# EAGLE design FRDM-Robot-Rev1.9 (EAGLE 6.4)
FRDM-Robot Board
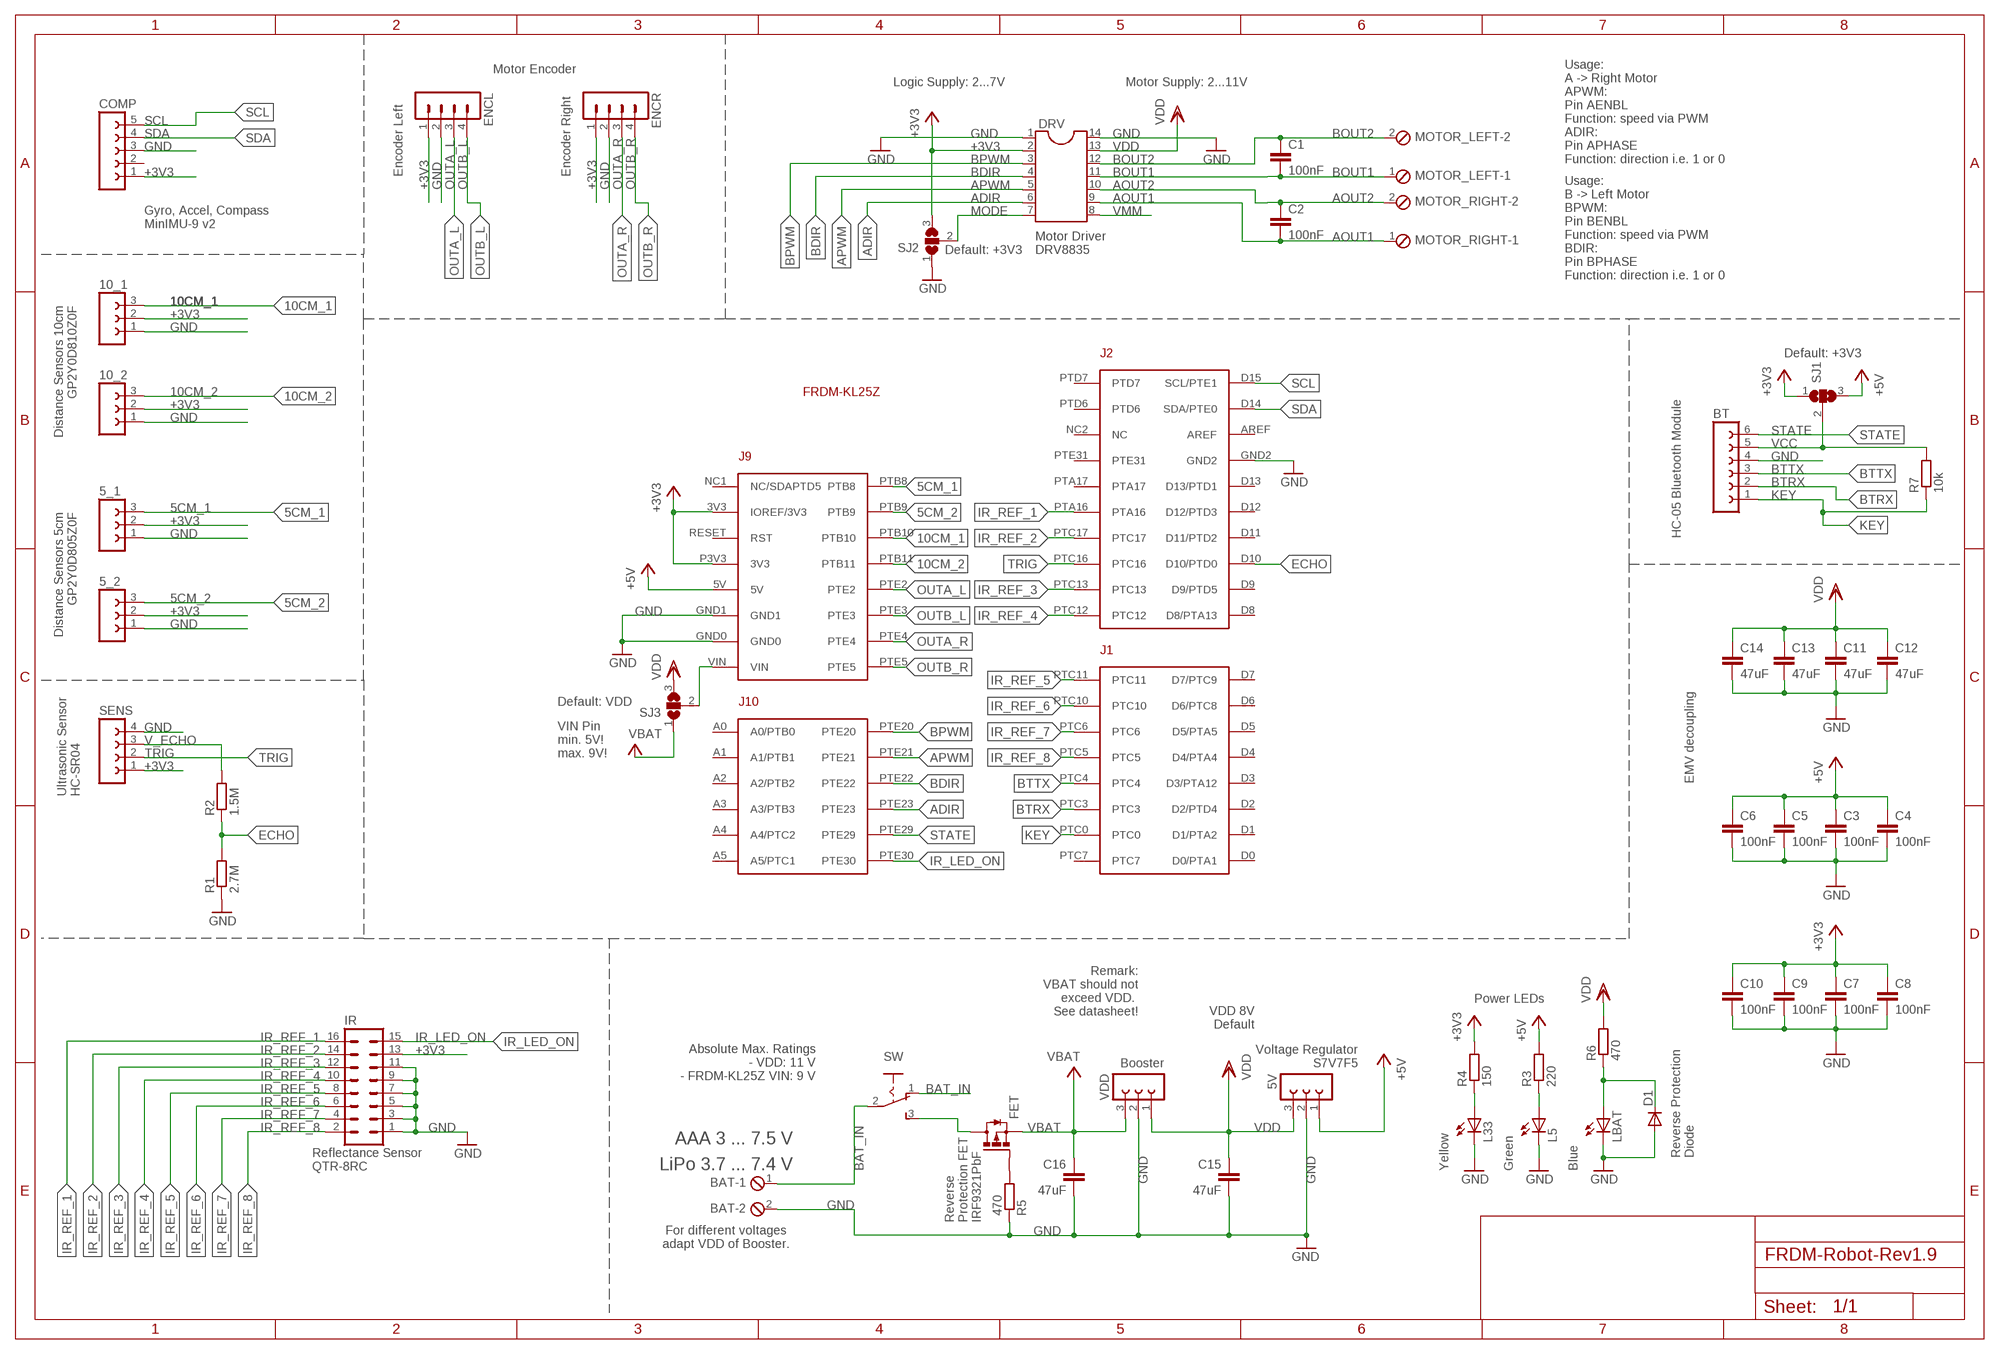
[diagram p0: schematic, sheet 1]

## Parts
5_1  FE03-1  [FE03-1]
5_2  FE03-1  [FE03-1]
5V  FE03-1  [FE03-1]
10_1  FE03-1  [FE03-1]
10_2  FE03-1  [FE03-1]
BAT  MPT2  [2POL254]
BT  FE06-1  [FE06]
C1  100nF  C-EUC0805  [C0805]
C2  100nF  C-EUC0805  [C0805]
C3  100nF  C-EUC0805  [C0805]
C4  100nF  C-EUC0805  [C0805]
C5  100nF  C-EUC0805  [C0805]
C6  100nF  C-EUC0805  [C0805]
C7  100nF  C-EUC0805  [C0805]
C8  100nF  C-EUC0805  [C0805]
C9  100nF  C-EUC0805  [C0805]
C10  100nF  C-EUC0805  [C0805]
C11  47uF  C-EUC0805  [C0805]
C12  47uF  C-EUC0805  [C0805]
C13  47uF  C-EUC0805  [C0805]
C14  47uF  C-EUC0805  [C0805]
C15  47uF  C-EUC0805  [C0805]
C16  47uF  C-EUC0805  [C0805]
COMP  FE05-1  [FE05-1]
D1  DIODE-SOD123  [SOD123]
DRV  DIL14  [DIL14]
ENCL  MA04-1  [MA04-1]
ENCR  MA04-1  [MA04-1]
FET  P-MOSFET-SO8  [SO-08]
FRDM1  FRDM-KL25ZARDUINO  [FRDM-KL25Z]
IR  MA08-2  [MA08-2]
L5  LEDCHIP-LED0603  [CHIP-LED0603]
L33  LEDCHIP-LED0603  [CHIP-LED0603]
LBAT  LEDCHIP-LED0603  [CHIP-LED0603]
MOTOR_LEFT  MPT2  [2POL254]
MOTOR_RIGHT  MPT2  [2POL254]
R1  2.7M  R-EU_M0805  [M0805]
R2  1.5M  R-EU_M0805  [M0805]
R3  220  R-EU_M0805  [M0805]
R4  150  R-EU_M0805  [M0805]
R5  470  R-EU_M0805  [M0805]
R6  470  R-EU_M0805  [M0805]
R7  10k  R-EU_M0805  [M0805]
SENS  FE04-1  [FE04-1]
SJ1  SJ2W  [SJ_2]
SJ2  SJ2W  [SJ_2]
SJ3  SJ2W  [SJ_2]
SW  KNITTER-MFP106D  [KNITTER-MFP106D]
VDD  FE03-1  [FE03-1]

## Nets
5CM_1: 5_1.3 FRDM1.PTB8
5CM_2: 5_2.3 FRDM1.PTB9
10CM_1: 10_1.3 FRDM1.PTB10
10CM_2: 10_2.3 FRDM1.PTB11
+3V3: 5_1.2 5_2.2 10_1.2 10_2.2 C7.1 C8.1 C9.1 C10.1 COMP.1 DRV.2 ENCL.1 ENCR.1 FRDM1.3V3(IOREF/3V3) FRDM1.P3V3(3V3) IR.13 R4.2 SENS.1 SJ1.1 SJ2.3
+5V: 5V.1 C3.1 C4.1 C5.1 C6.1 FRDM1.5V R3.2 SJ1.3
ADIR: DRV.6 FRDM1.PTE23
AOUT1: C2.2 DRV.9 MOTOR_RIGHT.1
AOUT2: C2.1 DRV.10 MOTOR_RIGHT.2
APWM: DRV.5 FRDM1.PTE21
BAT-FET: FET.5(D) FET.6(D) FET.7(D) FET.8(D) SW.3(S)
BAT_IN: BAT.1 SW.1(O) SW.2(P)
BDIR: DRV.4 FRDM1.PTE22
BOUT1: C1.2 DRV.11 MOTOR_LEFT.1
BOUT2: C1.1 DRV.12 MOTOR_LEFT.2
BPWM: DRV.3 FRDM1.PTE20
BTRX: BT.2 FRDM1.PTC3
BTTX: BT.3 FRDM1.PTC4
ECHO: FRDM1.D10(D10/PTD0) R1.2 R2.1
GND: 5_1.1 5_2.1 5V.2 10_1.1 10_2.1 BAT.2 BT.4 C3.2 C4.2 C5.2 C6.2 C7.2 C8.2 C9.2 C10.2 C11.2 C12.2 C13.2 C14.2 C15.2 C16.2 COMP.3 D1.A DRV.1 DRV.14 ENCL.2 ENCR.2 FRDM1.GND0 FRDM1.GND1 FRDM1.GND2 IR.1 IR.3 IR.5 IR.7 IR.9 IR.11 L5.C L33.C LBAT.C R1.1 R5.1 SENS.4 SJ2.1 VDD.2
IR_LED_ON: FRDM1.PTE30 IR.15
IR_REF_1: FRDM1.PTA16 IR.16
IR_REF_2: FRDM1.PTC17 IR.14
IR_REF_3: FRDM1.PTC13 IR.12
IR_REF_4: FRDM1.PTC12 IR.10
IR_REF_5: FRDM1.PTC11 IR.8
IR_REF_6: FRDM1.PTC10 IR.6
IR_REF_7: FRDM1.PTC6 IR.4
IR_REF_8: FRDM1.PTC5 IR.2
KEY: BT.1 FRDM1.PTC0 R7.1
MODE: DRV.7 SJ2.2
N$1: L5.A R3.1
N$3: L33.A R4.1
N$5: FET.4(G) R5.2
N$6: D1.C LBAT.A R6.1
OUTA_L: ENCL.3 FRDM1.PTE2
OUTA_R: ENCR.3 FRDM1.PTE4
OUTB_L: ENCL.4 FRDM1.PTE3
OUTB_R: ENCR.4 FRDM1.PTE5
SCL: COMP.5 FRDM1.D15(SCL/PTE1)
SDA: COMP.4 FRDM1.D14(SDA/PTE0)
STATE: BT.6 FRDM1.PTE29
TRIG: FRDM1.PTC16 SENS.2
V_ECHO: R2.2 SENS.3
VBAT: C16.1 FET.1(S) FET.2(S) FET.3(S) SJ3.1 VDD.3
VCC: BT.5 R7.2 SJ1.2
VDD: 5V.3 C11.1 C12.1 C13.1 C14.1 C15.1 DRV.13 R6.2 SJ3.3 VDD.1
VIN: FRDM1.VIN SJ3.2
VMM: DRV.8
Unconnected: COMP.2 FRDM1.A0(A0/PTB0) FRDM1.A1(A1/PTB1) FRDM1.A2(A2/PTB2) FRDM1.A3(A3/PTB3) FRDM1.A4(A4/PTC2) FRDM1.A5(A5/PTC1) FRDM1.AREF FRDM1.D0(D0/PTA1) FRDM1.D1(D1/PTA2) FRDM1.D2(D2/PTD4) FRDM1.D3(D3/PTA12) FRDM1.D4(D4/PTA4) FRDM1.D5(D5/PTA5) FRDM1.D6(D6/PTC8) FRDM1.D7(D7/PTC9) FRDM1.D8(D8/PTA13) FRDM1.D9(D9/PTD5) FRDM1.D11(D11/PTD2) FRDM1.D12(D12/PTD3) FRDM1.D13(D13/PTD1) FRDM1.NC1(NC/SDAPTD5) FRDM1.NC2(NC) FRDM1.PTA17 FRDM1.PTC7 FRDM1.PTD6 FRDM1.PTD7 FRDM1.PTE31 FRDM1.RESET(RST)

## Notes on the sheet
- Motor Encoder
- Logic Supply: 2...7V | Motor Supply: 2...11V
- Usage:
  A -> Right Motor
  APWM: 
  Pin AENBL 
  Function: speed via PWM
  ADIR: 
  Pin APHASE 
  Function: direction i.e. 1 or 0
- Encoder Left | Encoder Right
- Gyro, Accel, Compass
  MinIMU-9 v2
- Default: +3V3
- Motor Driver
  DRV8835
- Usage:
  B -> Left Motor
  BPWM: 
  Pin BENBL 
  Function: speed via PWM
  BDIR: 
  Pin BPHASE 
  Function: direction i.e. 1 or 0
- Distance Sensors 10cm
  GP2Y0D810Z0F
- Default: +3V3
- Distance Sensors 5cm
  GP2Y0D805Z0F
- HC-05 Bluetooth Module
- Default: VDD
- VIN Pin
  min. 5V!
  max. 9V!
- EMV decoupling
- Ultrasonic Sensor
  HC-SR04
- Power LEDs
- Remark:
  VBAT should not
  exceed VDD. 
  See datasheet!
- VDD 8V
  Default
- Booster
- Voltage Regulator
  S7V7F5
- Absolute Max. Ratings
  - VDD: 11 V
  - FRDM-KL25Z VIN: 9 V
- AAA 3 ... 7.5 V
- Reverse Protection
  Diode
- Reflectance Sensor
  QTR-8RC
- LiPo 3.7 ... 7.4 V | Yellow | Green | Blue
- Reverse
  Protection FET
  IRF9321PbF
- For different voltages 
  adapt VDD of Booster.

## Library data of the parts
5_1 5_2 5V 10_1 10_2 VDD = con-lsta-FRDM:FE03-1: Female Header
BAT MOTOR_LEFT MOTOR_RIGHT = con-phoenix-254-FRDM:MPT2: PHOENIX CONNECTOR; OC_FARNELL: unknown; OC_NEWARK: unknown
BT = con-lsta-FRDM:FE06-1: FEMALE HEADER; OC_FARNELL: unknown; OC_NEWARK: unknown
C1-C16 = rcl:C-EU: CAPACITOR, European symbol
COMP = con-lsta-FRDM:FE05-1: FEMALE HEADER; OC_FARNELL: unknown; OC_NEWARK: unknown
D1 = diode:DIODE-: DIODE
DRV = ic-package-FRDM:DIL14: Dual In Line / Socket
ENCL ENCR = con-lstb-FRDM:MA04-1: PIN HEADER; OC_FARNELL: unknown; OC_NEWARK: unknown
FET = transistor-power-IRF-FRDM:P-MOSFET-SO8: P-Channel MOSFET Example: FDS4435A; P-Channel Logic Level PowerTrench® MOSFET FDS4465; P-Channel 1.8V Specified PowerTrench® MOSFET Source: www.fairchildsemi.com
FRDM1 = Freedom:FRDM-KL25Z: For creating FRDM-KL25Z shields
IR = con-lstb-FRDM:MA08-2: PIN HEADER; OC_FARNELL: unknown; OC_NEWARK: unknown
L5 L33 LBAT = led:LED: LED OSRAM: - CHIPLED LG R971, LG N971, LY N971, LG Q971, LY Q971, LO R971, LY R971 LH N974, LH R974 LS Q976, LO Q976, LY Q976 LO Q996 - Hyper CHIPLED LW Q18S LB Q993, LB Q99A, LB R99A - SideLED LS A670, LO A670, LY A670, LG A670, LP A670 LB A673, LV A673, LT A673, LW A673 LH A674 LY A675 LS A676, LA A676, LO A676, LY A676, LW A676 LS A679, LY A679, LG A679 - Hyper Micro SIDELED® LS Y876, LA Y876, LO Y876, LY Y876 LT Y87S - SmartLED LW L88C, LW L88S LB L89C, LB L89S, LG L890 LS L89K, LO L89K, LY L89K LS L896, LA L896, LO L896, LY L896 - TOPLED LS T670, LO T670, LY T670, LG T670, LP T670 LSG T670, LSP T670, LSY T670, LOP T670, LYG T670 LG T671, LOG T671, LSG T671 LB T673, LV T673, LT T673, LW T673 LH T674 LS T676, LA T676, LO T676, LY T676, LB T676, LH T676, LSB T676, LW T676 LB T67C, LV T67C, LT T67C, LS T67K, LO T67K, LY T67K, LW E67C LS E67B, LA E67B, LO E67B, LY E67B, LB E67C, LV E67C, LT E67C LW T67C LS T679, LY T679, LG T679 LS T770, LO T770, LY T770, LG T770, LP T770 LB T773, LV T773, LT T773, LW T773 LH T774 LS E675, LA E675, LY E675, LS T675 LS T776, LA T776, LO T776, LY T776, LB T776 LHGB T686 LT T68C, LB T68C - Hyper Mini TOPLED® LB M676 - Mini TOPLED Santana® LG M470 LS M47K, LO M47K, LY M47K Source: http://www.osram.convergy.de LUXEON: - LUMILED® LXK2-PW12-R00, LXK2-PW12-S00, LXK2-PW14-U00, LXK2-PW14-V00 LXK2-PM12-R00, LXK2-PM12-S00, LXK2-PM14-U00 LXK2-PE12-Q00, LXK2-PE12-R00, LXK2-PE12-S00, LXK2-PE14-T00, LXK2-PE14-U00 LXK2-PB12-K00, LXK2-PB12-L00, LXK2-PB12-M00, LXK2-PB14-N00, LXK2-PB14-P00, LXK2-PB14-Q00 LXK2-PR12-L00, LXK2-PR12-M00, LXK2-PR14-Q00, LXK2-PR14-R00 LXK2-PD12-Q00, LXK2-PD12-R00, LXK2-PD12-S00 LXK2-PH12-R00, LXK2-PH12-S00 LXK2-PL12-P00, LXK2-PL12-Q00, LXK2-PL12-R00 Source: www.luxeon.com KINGBRIGHT: KA-3528ASYC Source: www.kingbright.com
R1-R7 = resistor:R-EU_: RESISTOR, European symbol
SENS = con-lsta-FRDM:FE04-1: Female Header
SJ1-SJ3 = jumper:SJ2W: SMD solder JUMPER
SW = switch-FRDM:KNITTER-MFP106D: SLIDING SWITCH Knitter-Switch MFP 106 D Farnell <http://ch.farnell.com/knitter-switch/mfp106d/schiebeschalter-ein-ein/dp/807527>; FARNELL: 807527

## Net classes
0 default: clearance 0.355 mm

## Board
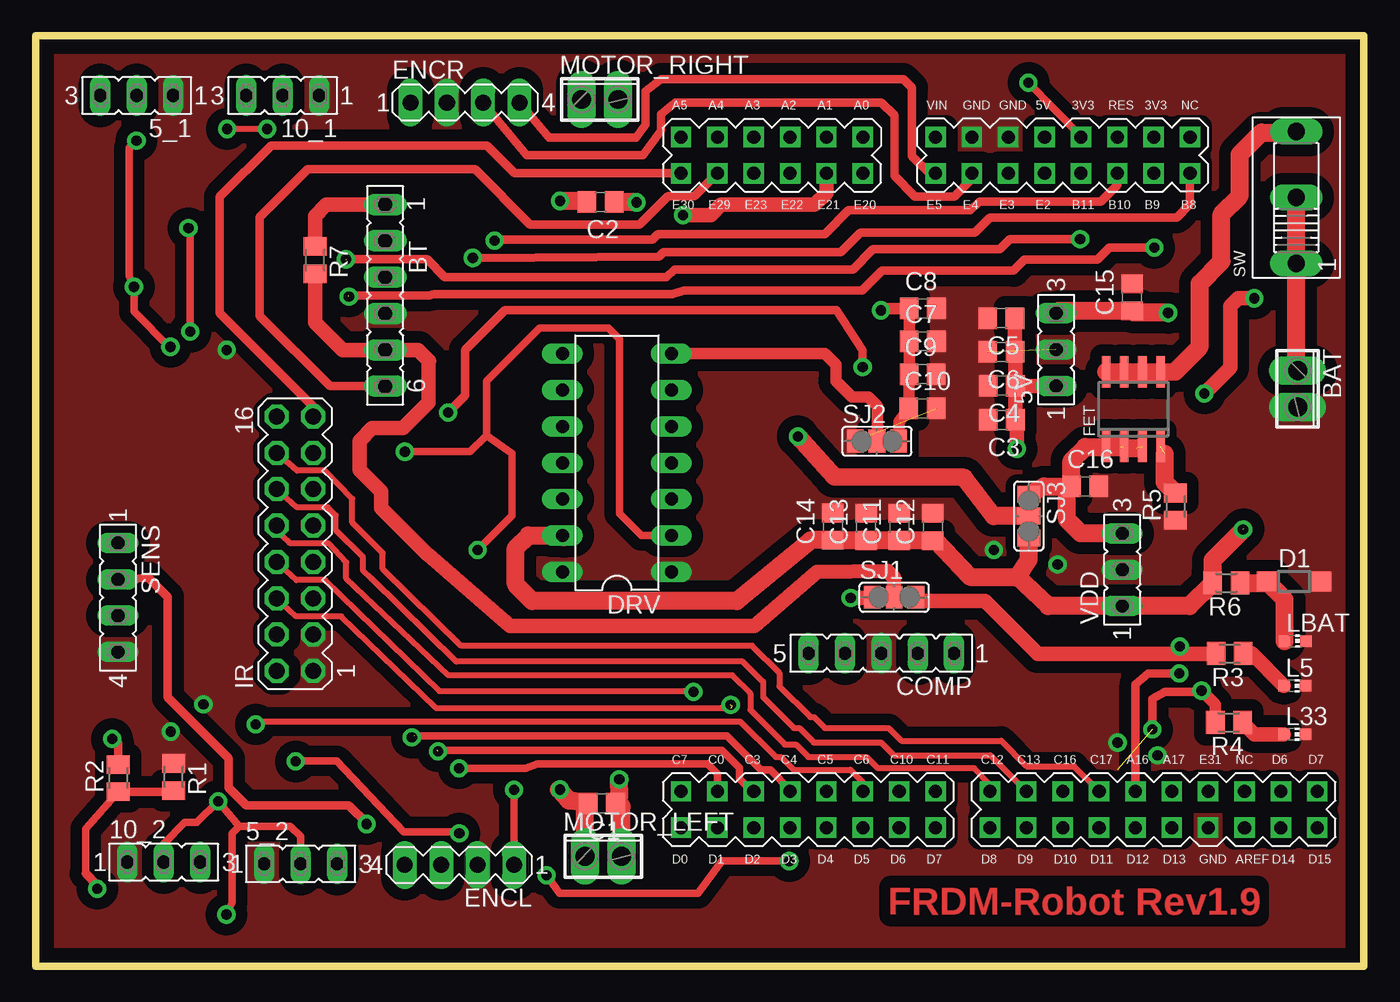
[diagram p1: board, top side]
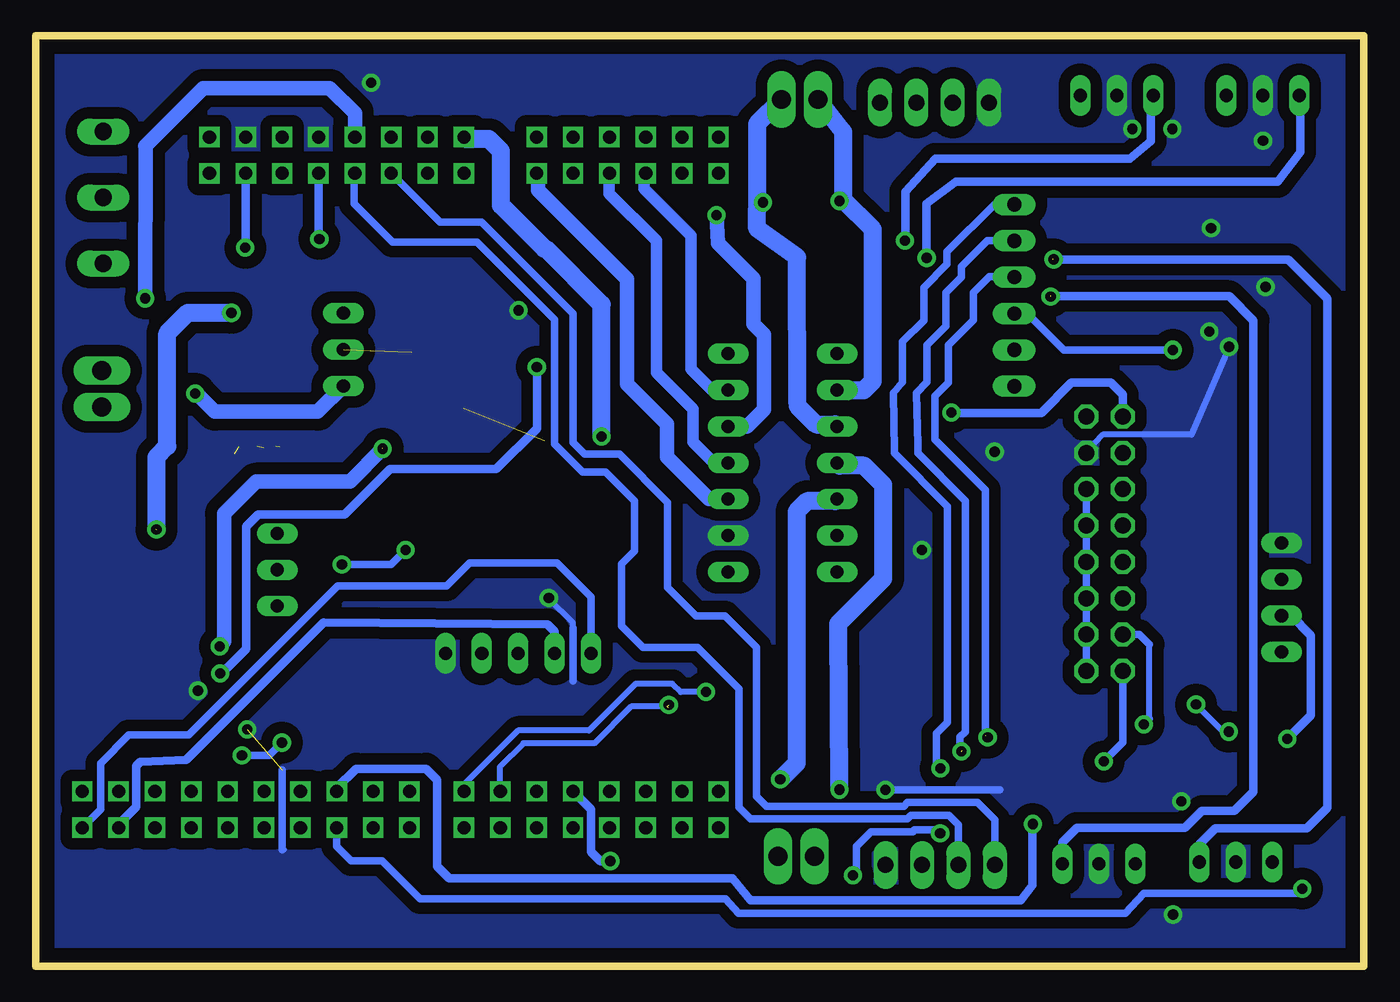
[diagram p2: board, bottom side, seen from below]

Size 92.76 x 65 mm. Coordinates in mm from the lower left corner, seen from the top.
Outline: 0,0 92.76,0 92.76,65 0,65 0,0
Copper layers (1*16): Top 0.035mm / dielectric 1.5mm / Bottom 0.035mm
Design rules "default": minimum track width 10mil, minimum drill 24mil, track to track 8mil, track to pad 8mil, pad to pad 8mil, via to via 8mil, smd to smd 8mil, copper to edge 40mil, drill to drill 8mil, minimum pad ring 10mil, minimum via ring 8mil, stop-mask expansion 4mil, vias tented up to drill 0mil, thermal gap 10mil

### Footprints (pad centres in the part's own frame; a part is rotated, then mirrored left to right if it is on the bottom)
FE03-1 = drill 0.914 long: 1 -2.54,0; 2 0,0; 3 2.54,0
2POL254 = drill 1.321 long: 1 -1.27,0; 2 1.27,0
FE06 = drill 0.991 long: 1 -6.35,0; 2 -3.81,0; 3 -1.27,0; 4 1.27,0; 5 3.81,0; 6 6.35,0
C0805 = smd 1.3 x 1.5: 1 -0.95,0; 2 0.95,0
FE05-1 = drill 0.914 long: 1 -5.08,0; 2 -2.54,0; 3 0,0; 4 2.54,0; 5 5.08,0
SOD123 = smd 1.4 x 1.4: A 1.9,0; C -1.9,0
DIL14 = drill 0.914 long: 1 -7.62,-3.81; 2 -5.08,-3.81; 3 -2.54,-3.81; 4 0,-3.81; 5 2.54,-3.81; 6 5.08,-3.81; 7 7.62,-3.81; 8 7.62,3.81; 9 5.08,3.81; 10 2.54,3.81; 11 0,3.81; 12 -2.54,3.81; 13 -5.08,3.81; 14 -7.62,3.81
MA04-1 = drill 1.118 long: 1 -3.81,0; 2 -1.27,0; 3 1.27,0; 4 3.81,0
SO-08 = smd 0.6 x 2.2: 1 -1.905,-2.6; 2 -0.635,-2.6; 3 0.635,-2.6; 4 1.905,-2.6; 5 1.905,2.6; 6 0.635,2.6; 7 -0.635,2.6; 8 -1.905,2.6
FRDM-KL25Z = drill 0.914 square: 3V3 -22.86,12.7; 5V -22.86,5.08; A0 -22.86,-7.62; A1 -22.86,-10.16; A2 -22.86,-12.7; A3 -22.86,-15.24; A4 -22.86,-17.78; A5 -22.86,-20.32; AREF 25.4,19.05; D0 25.4,-20.32; D1 25.4,-17.78; D2 25.4,-15.24; D3 25.4,-12.7; D4 25.4,-10.16; D5 25.4,-7.62; D6 25.4,-5.08; D7 25.4,-2.54; D8 25.4,1.27; D9 25.4,3.81; D10 25.4,6.35; D11 25.4,8.89; D12 25.4,11.43; D13 25.4,13.97; D14 25.4,21.59; D15 25.4,24.13; GND0 -22.86,0; GND1 -22.86,2.54; GND2 25.4,16.51; NC1 -22.86,15.24; NC2 22.86,19.05; P3V3 -22.86,7.62; PTA16 22.86,11.43; PTA17 22.86,13.97; PTB8 -20.32,15.24; PTB9 -20.32,12.7; PTB10 -20.32,10.16; PTB11 -20.32,7.62; PTC0 22.86,-17.78; PTC3 22.86,-15.24; PTC4 22.86,-12.7; PTC5 22.86,-10.16; PTC6 22.86,-7.62; PTC7 22.86,-20.32; PTC10 22.86,-5.08; PTC11 22.86,-2.54; PTC12 22.86,1.27; PTC13 22.86,3.81; PTC16 22.86,6.35; PTC17 22.86,8.89; PTD6 22.86,21.59; PTD7 22.86,24.13; PTE2 -20.32,5.08; PTE3 -20.32,2.54; PTE4 -20.32,0; PTE5 -20.32,-2.54; PTE20 -20.32,-7.62; PTE21 -20.32,-10.16; PTE22 -20.32,-12.7; PTE23 -20.32,-15.24; PTE29 -20.32,-17.78; PTE30 -20.32,-20.32; PTE31 22.86,16.51; RESET -22.86,10.16; VIN -22.86,-2.54
MA08-2 = drill 1.118 octagon: 1 -8.89,-1.27; 2 -8.89,1.27; 3 -6.35,-1.27; 4 -6.35,1.27; 5 -3.81,-1.27; 6 -3.81,1.27; 7 -1.27,-1.27; 8 -1.27,1.27; 9 1.27,-1.27; 10 1.27,1.27; 11 3.81,-1.27; 12 3.81,1.27; 13 6.35,-1.27; 14 6.35,1.27; 15 8.89,-1.27; 16 8.89,1.27
CHIP-LED0603 = smd 0.8 x 0.8: A 0,-0.75; C 0,0.75
M0805 = smd 1.3 x 1.6: 1 -0.95,0; 2 0.95,0
FE04-1 = drill 0.914 long: 1 -5.08,0; 2 -2.54,0; 3 0,0; 4 2.54,0
SJ_2 = smd 1.168 x 1.6: 1 -1.524,0; 2 0,0; 3 1.524,0
KNITTER-MFP106D = drill 1.219 long: 1 -4.61,0; 2 0,0; 3 4.61,0

### Placement (x,y rotation side)
5_1  7.05,60.83 180 top
5_2  18.5,7.15 0 top
5V  71.27,43.07 90 top
10_1  17.24,60.83 180 top
10_2  8.93,7.27 0 top
BAT  88.15,40.33 270 top
BT  24.41,46.86 270 top
C1  39.55,11.37 180 top
C2  39.45,53.39 180 top
C3  67.48,38.17 180 top
C4  67.48,40.56 180 top
C5  67.45,45.27 180 top
C6  67.45,42.91 180 top
C7  61.96,43.65 0 top
C8  61.97,45.94 0 top
C9  61.95,41.35 0 top
C10  61.93,38.97 0 top
C11  60.32,30.69 90 top
C12  62.66,30.68 90 top
C13  57.99,30.69 90 top
C14  55.68,30.71 90 top
C15  76.57,46.73 90 top
C16  73.3,33.52 0 top
COMP  59.07,21.86 180 top
D1  87.89,26.86 0 top
DRV  40.59,35.17 90 top
ENCL  29.58,7.07 180 top
ENCR  29.98,60.34 0 top
FET  76.67,38.91 0 top
FRDM1  65.39,35.07 270 top
IR  18.11,29.51 90 top
L5  87.94,19.58 270 top
L33  87.94,16.2 270 top
LBAT  88,22.72 270 top
MOTOR_LEFT  39.63,7.67 0 top
MOTOR_RIGHT  39.39,60.55 0 top
R1  9.63,13.22 270 top
R2  5.76,13.13 90 top
R3  83.39,21.84 180 top
R4  83.35,17.03 180 top
R5  79.61,32.11 90 top
R6  83.17,26.78 180 top
R7  19.52,49.33 270 top
SENS  5.74,24.49 270 top
SJ1  59.96,25.78 0 top
SJ2  58.76,36.67 0 top
SJ3  69.37,31.45 270 top
SW  88.05,53.7 90 top
VDD  75.89,27.69 90 top

### Tracks (layer width: path | path; a pad name or v marks a point on that pad's centre or on a via)
5CM_1  (via drill 0.71 pad 1.27)
  Top 0.61: FRDM1.PTB8 80.63,53.22 79.7,52.3 66.65,52.3 65.61,51.26 57.61,51.26 56.24,49.89 43.87,49.89 43.54,49.55 v30.53,49.48
  Bottom 0.61: v30.53,49.48 30.53,53.26 28.5,54.8 6.02,54.8 4.45,56.87 4.45,60.77 5_1.3
5CM_2  (via drill 0.71 pad 1.27)  (1 unrouted)
  Top 0.61: v78.13,50.19 74.98,50.19 74.14,49.35 69.06,49.35 68.3,48.59 59.11,48.59 57.71,47.19 45.24,47.19 44.48,46.94 27.81,46.94 27.43,46.86 21.87,46.86
  Bottom 0.406: v78.13,50.19 78.13,50.27
  Bottom 0.61: FRDM1.PTB9 78.09,50.31 78.13,50.27 | 5_2.3 21.04,8.66 20.04,9.65 12.5,9.65 11.3,10.85 9.04,10.85 7.7,12.19 7.7,45.11 9.4,46.81 21.84,46.81 v21.87,46.79
10CM_1  (via drill 0.71 pad 1.27)
  Top 0.61: FRDM1.PTB10 75.55,54.57 74.4,53.42 65.91,53.42 65.3,52.81 56.77,52.81 55.12,51.16 43.46,51.16 43.08,50.78 32.13,50.78 v32.05,50.7
  Bottom 0.406: 32.03,50.65 32.03,50.67 v32.05,50.7
  Bottom 0.61: 14.86,60.67 10_1.3 14.88,60.64 14.88,57.63 16.32,56.4 29.93,56.4 32.03,54.1 32.03,50.65
10CM_2  (via drill 0.71 pad 1.27)  (1 unrouted)
  Top 0.61: v72.95,50.8 68.05,50.8 67.33,50.09 58.5,50.09 57.07,48.67 44.6,48.67 44.07,48.13 28.55,48.13 27.33,49.4 21.72,49.4 21.69,49.33
  Bottom 0.406: 73.01,50.87 73.01,50.86 v72.95,50.8
  Bottom 0.61: FRDM1.PTB11 73.01,50.87 73.05,50.83 | 10_2.3 11.47,8.52 10.36,9.63 3.96,9.63 2.54,11.05 2.54,46.63 5.28,49.38 v21.67,49.38
+3V3  (via drill 0.71 pad 1.27)  (1 unrouted)
  Top 0.406: 6.53,57.18 v7.03,57.68 | v13.36,58.5 v16.15,58.5 | 10_2.2 8.93,8.22 | v12.74,11.52 12.6,11.63 | 7.04,47.28 v6.86,47.46 | 18.54,7.19 5_2.2 | 13.61,4.34 v13.32,3.6
  Top 0.508: v69.34,61.72 73.02,57.94 FRDM1.P3V3 | DRV.2 42.3,30.08 40.77,31.62 40.77,43.82 40.01,44.58 35.18,44.58 31.5,40.89 31.5,37.08 | 31.5,37.08 30.35,35.94 v25.78,35.94 | 31.5,37.08 33.27,35.81 33.27,31.5 30.99,29.21 | v10.79,44.32 10.79,51.44 v10.67,51.56 | ENCL.1 33.39,12.31 v33.4,12.32 | 6.53,57.18 6.53,48.21 v6.86,47.46 6.86,45.72 9.4,43.18 | 8.93,8.22 8.93,8.55 10.41,10.03 11.25,10.03 v12.74,11.52 14.2,9.78 14.22,9.78 | 5_2.2 18.5,9.06 17.78,9.78 14.22,9.78 | v13.32,3.6 13.72,4.45 13.72,9.27 14.22,9.78
  Top 0.61: v81.43,19.25 81.36,19.18 78.87,19.18 78,18.66 v78,16.54
  Top 0.813: R4.2 82.39,18.29 v81.43,19.25 | SJ2.3 60.28,38.01 C10.1 61,38.98 C9.1 61.01,41.37 C7.1 C8.1 59.15,45.94 v59.03,45.82
  Top 1.016: SJ1.1 58.39,25.73 v56.92,25.73
  Bottom 0.406: v9.4,43.27 12.03,37.14 18.23,37.14 19.38,35.93 IR.13 | 55.25,23.62 55.25,24 56.9,25.65 | 75.44,8.13 75.56,8.13
  Bottom 0.508: 25.4,12.32 v33.4,12.32 | 55.25,23.62 55.25,19.94 | 75.56,8.13 75.56,13.72
  other vias: 30.86,29.08
  pour Bottom (isolate 0.813, no thermals): 0.38,0.38 91.69,0.38 91.69,64.64 0.38,64.64
+5V  (via drill 0.71 pad 1.27)  (1 unrouted)
  Top 0.406: 85.13,46.67 v85.12,46.66
  Top 1.016: 68.54,36.21 68.54,38.05 C3.1 68.43,39.78 | 68.43,39.78 C4.1 68.43,42.88 C6.1 | C6.1 C5.1 | C5.1 | 68.43,42.88 C6.1 | 5V.1 68.56,40.53 68.43,39.78 | 79.89,21.81 70.02,21.81 66.29,25.53 61.73,25.53 SJ1.3 | 79.89,21.81 82.4,21.81 R3.2 | 79.89,21.81 79.89,22.31 v79.91,22.33 | v81.64,40.01 83.44,41.81 83.44,46.1 84,46.66 v85.12,46.66
  Bottom 1.016: FRDM1.5V 70.47,59.6 72.22,61.35 81.07,61.35 85.13,57.29 85.09,57.29 v85.12,46.66 | v79.91,22.33 79.6,22.68 79.6,31.62 77.37,33.86 70.82,33.86 v68.53,36.15 | 5V.1 73.07,38.73 80.26,38.73 81.53,40.01 v81.64,40.01
ADIR
  Bottom 0.813: DRV.6 45.53,40.25 46.99,41.71 46.99,51.05 50.27,54.33 50.27,55.27 FRDM1.PTE23
AOUT1  (via drill 0.71 pad 1.27)
  Top 1.27: v36.63,53.47 38.42,53.47 C2.2
  Bottom 1.27: MOTOR_RIGHT.1 36.37,58.29 36.37,53.57 | DRV.9 34.91,40.25 34.29,40.87 34.29,51.49 36.37,53.57 | 36.37,53.57 36.53,53.57 v36.63,53.47
AOUT2  (via drill 0.71 pad 1.27)
  Top 1.27: v41.96,53.37 40.42,53.37 C2.1
  Bottom 1.27: MOTOR_RIGHT.2 42.37,58.85 42.37,52.96 | 42.37,52.96 42.37,51.54 39.57,49.53 39.55,39.27 39.55,39.14 38.25,37.85 36.92,37.85 DRV.10 | 42.37,52.96 v41.96,53.37
APWM  (via drill 0.71 pad 1.27)
  Top 1.016: FRDM1.PTE21 55.22,54 54.41,53.19 47.88,53.19 47.17,52.48 v45.21,52.48
  Bottom 1.016: v45.21,52.48 45.11,50.52 42.62,48.03 42.62,44.86 41.89,44.12 41.89,38.89 43.07,37.71 DRV.5
BAT-FET
  Top 1.27: FET.8 FET.7 FET.6 FET.5 79.59,41.54 81.3,43.26 81.3,47.7 82.83,49.23 82.83,52.53 84.1,53.8 84.1,56.72 85.62,58.24 87.6,58.24 SW.3
BAT_IN
  Top 1.27: SW.2 SW.1 88.05,42.08 BAT.1
BDIR
  Bottom 0.813: DRV.4 45.4,35.16 46.86,36.63 46.86,38.94 49.4,41.48 49.4,50.67 52.71,53.98 52.71,55.37 FRDM1.PTE22
BOUT1  (via drill 0.71 pad 1.27)
  Top 1.27: MOTOR_LEFT.1 38.37,8.11 38.37,11.34 C1.2 37.22,11.57 36.55,12.33 v36.62,12.33
  Bottom 1.27: v36.62,12.33 36.7,23.93 33.55,27.08 33.55,33.63 34.9,34.98 36.59,34.98 DRV.11
BOUT2  (via drill 0.71 pad 1.27)
  Top 1.27: MOTOR_LEFT.2 40.93,8.33 40.93,11.14 C1.1 40.77,11.84 v40.76,13.04
  Bottom 1.27: DRV.12 36.92,32.49 38.89,32.49 39.62,31.75 39.62,14.18 v40.76,13.04
BPWM
  Bottom 1.016: DRV.3 45.73,32.62 48.67,35.56 48.67,37.87 51.46,40.66 51.46,48.01 57.68,54.23 57.68,55.3 FRDM1.PTE20
BTRX  (via drill 0.71 pad 1.27)  (1 unrouted)
  Top 0.508: 28.04,15.09 47.93,15.09 49.15,13.87 49.15,13.08 50.02,12.21 FRDM1.PTC3
  Bottom 0.508: BT.2 26.29,50.67 28.09,48.87 28.09,48.13 29.18,47.04 29.18,44.73 30.5,43.41 30.5,40.79 31.24,40.06 31.14,36.42 31.14,35.84 27.81,32.51 27.81,16.38 28.19,16 28.19,15.11 v28.09,15.01
BTTX  (via drill 0.71 pad 1.27)  (1 unrouted)
  Top 0.508: 26.42,16.1 48.29,16.1 50.67,13.72 51.31,13.72 52.69,12.33 FRDM1.PTC4 52.65,12.24
  Bottom 0.508: BT.3 24.43,48.16 26.16,48.16 27.25,47.07 27.25,45.14 29.01,43.38 29.01,40.77 29.95,39.83 29.95,36.8 26.42,33.27 26.42,16.13 v26.26,15.98 26.29,16.38
ECHO  (via drill 0.71 pad 1.27)
  Top 0.508: 3.48,6.48 3.48,9.6 R2.1
  Top 0.61: R2.1 9.54,12.18 R1.2 | 3.48,6.48 4.29,5.66 v4.29,5.41
  Bottom 0.508: v4.29,5.41 4.62,5.08 15.37,5.08 16.64,3.68 43.69,3.68 44.58,4.7 65.91,4.7 68.58,7.37 70.74,7.37 71.74,8.37 FRDM1.D10
GND  (via drill 0.71 pad 1.27)  (2 unrouted)
  Bottom 0.406: v9.43,16.38 9.81,16.38 v11.72,18.28
  Bottom 0.508: IR.3 IR.5 IR.7 IR.9 IR.11 | IR.1 19.38,23.19 19.43,23.24 | v13.34,43.05 20.95,43.05 23.49,45.59 BT.4 | v75.56,15.62 76.45,14.73 v78.36,14.73 | v66.93,29.08 67.94,28.07 v71.37,28.07
  pour Top (isolate 0.813, no thermals): 0.17,0.17 91.69,0.38 91.69,64.64 0.05,64.64
IR_LED_ON
  Top 0.61: FRDM1.PTE30 33.46,55.39 31.52,57.33 16.43,57.33 12.85,53.75 12.85,45.62 19.53,38.94 19.53,38.55 IR.15
IR_REF_1  (via drill 0.71 pad 1.27)
  Top 0.406: 57.73,41.83 v57.76,41.86
  Top 0.61: 57.73,41.83 57.73,43.03 55.93,45.85 32.77,45.85 29.97,43.05 29.97,39.85 v28.8,38.68 | FRDM1.PTA16 76.82,12.35 76.82,19.68 77.72,20.45 v79.88,20.45
  Bottom 0.406: 79.86,20.4 79.86,20.42 v79.88,20.45
  Bottom 0.61: IR.16 16.84,39.93 17.68,40.77 20.42,40.77 22.53,38.66 28.78,38.66 v28.8,38.68 | v57.76,41.86 57.76,37.57 60.6,34.72 68.02,34.72 71.17,31.57 77.22,31.57 78.08,30.71 78.08,22.17 79.86,20.4
IR_REF_2
  Top 0.406: IR.14 18.21,34.66 18.26,34.61 20.19,34.61 22.1,32.64 22.1,30.99 24.23,28.85 24.23,27.74 29.72,22.38 50.04,22.38 51.94,20.47 51.94,19.56 54.1,17.4 54.36,17.4 55.12,16.64 59.56,16.64 60.45,15.75 67.44,15.75 69.21,13.97 72.52,13.97 FRDM1.PTC17
IR_REF_3
  Top 0.406: IR.12 18.26,32.05 20.4,32.05 20.95,31.5 20.95,30.48 22.86,28.57 22.86,27.66 23.44,27.08 29.36,21.29 49.38,21.29 50.8,19.86 50.8,18.8 52.96,16.64 53.34,16.64 54.36,15.62 59.05,15.62 59.94,14.73 66.67,14.73 FRDM1.PTC13
IR_REF_4
  Top 0.406: 16.84,30.43 17.73,29.58 17.78,29.53 20.45,29.53 21.69,28.22 21.69,27.08 28.83,20.32 48.64,20.32 49.91,19.05 49.91,17.91 52.32,15.49 53.09,15.49 53.98,14.61 58.04,14.61 58.8,13.84 65.53,13.84 66.66,12.71 FRDM1.PTC12
  Top 0.508: 16.84,30.43 IR.10
IR_REF_5  (via drill 0.71 pad 1.27)
  Top 0.406: IR.8 18.21,26.97 20.22,26.97 28.19,19.23 45.82,19.23
  Top 0.508: 45.82,19.23 v45.95,19.15
  Bottom 0.406: v45.95,19.15 47.7,19.15 48.29,19.74 50.85,19.74 54.13,16.46 59.08,16.46 62.89,12.65 62.89,12.25
  Bottom 0.508: 62.89,12.25 FRDM1.PTC11
IR_REF_6  (via drill 0.71 pad 1.27)  (2 unrouted)
  Top 0.406: IR.6 18.19,24.43 21.34,24.43 27.96,18.03 48.54,18.03 48.57,18.03
  Bottom 0.406: 48.67,18.14 51.18,18.14 53.75,15.57 58.7,15.57 60.35,13.92 60.35,12.25
  Bottom 0.508: 60.3,12.22 FRDM1.PTC10 60.35,12.25
  other vias: 48.54,18.26
IR_REF_7  (via drill 0.71 pad 1.27)
  Top 0.406: 15.32,17.09 49.2,17.09 51.69,14.61 52.07,14.61 52.96,13.72 56.9,13.72 57.77,12.84 FRDM1.PTC6
  Top 0.508: 16.82,23.14 IR.4 16.81,23.19 | 15.32,17.09 v15.37,16.89
  Bottom 0.406: 14.99,17.27 14.99,22.48
  Bottom 0.508: v15.37,16.89 14.99,17.27 | 14.99,22.48 15.67,23.16 IR.4
IR_REF_8  (via drill 0.71 pad 1.27)
  Top 0.406: 52.71,7.37 52.65,7.37 v52.63,7.34 | v18.16,14.3 18.26,14.3 18.29,14.33
  Top 0.508: 52.71,7.37 47.93,7.37 46.25,5.08 36.57,5.08 v35.69,6.35 | 18.14,14.33 18.29,14.33 21.01,14.33 25.68,9.4 29.46,9.4 v29.59,9.27
  Bottom 0.508: v18.16,14.3 16.84,15.62 IR.2 | v35.69,6.35 35.43,6.73 35.43,8.38 34.42,9.4 31.5,9.4 31.37,9.53 30.1,9.53 29.84,9.27 v29.59,9.27
  Bottom 0.61: FRDM1.PTC5 53.98,10.95 53.98,8 53.32,7.34 v52.63,7.34
KEY  (via drill 0.71 pad 1.27)
  Top 0.508: FRDM1.PTC0 47.61,13.45 46.91,14.15 35.05,14.15 34.21,13.82 v29.57,13.82
  Top 1.016: BT.1 20.29,53.19 19.51,52.4 19.51,50.29 R7.1
  Bottom 0.508: BT.1 25.81,53.21 29.11,49.91 29.11,49.05 30.73,47.42 30.73,45.11 32.21,43.64 32.21,40.79 32.87,40.03 32.79,35.94 32.79,35.84 29.08,32.13 29.08,17.02 29.84,16.26 29.84,14.1 v29.57,13.82
MODE
  Top 0.813: SJ2.2 58.8,36.72 58.8,39.12 58.17,39.75 57.02,39.75 55.88,40.89 55.88,42.04 55.13,42.79 DRV.7 44.42,42.8
N$1
  Top 1.016: R3.1 84.93,21.84 L5.A
N$3
  Top 1.016: L33.A 85.13,16.2 R4.1
N$5  (1 unrouted)
  Top 1.27: R5.2 78.87,33.8 78.87,35.81
N$6
  Top 1.27: R6.1 85.91,26.78 D1.C 87.25,25.61 LBAT.A
OUTA_L
  Bottom 0.508: ENCL.3 28.31,9.86 28.99,10.54 31.62,10.54 31.88,10.29 31.88,10.28 42.83,10.28 43.63,11.08 43.63,19.38 46.53,22.28 50.33,22.28 51.83,23.78 51.83,28.1 50.93,29.01 50.93,32.51 50.95,32.51 52.96,34.52 54.57,34.52 56.53,36.48 56.53,45.18 61.93,50.58 67.83,50.58 70.53,53.28 70.53,55.33 FRDM1.PTE2
OUTA_R
  Top 0.61: FRDM1.PTE4 65.39,55 64.16,53.77 61.42,53.77 59.97,55.22 59.97,59.44 59.08,60.33 44.65,60.33 43.66,59.51 43.66,58.37 42.42,56.67 34.27,56.67 ENCR.3
OUTB_L
  Bottom 0.406: 51.97,35.71 51.97,35.76
  Bottom 0.508: ENCL.4 25.77,10.22 26.98,11.43 31.88,11.43 32.13,11.18 41.73,11.18 42.43,11.88 42.43,22.28 44.63,24.48 46.63,24.48 48.62,26.46 48.62,32.41 51.97,35.76 54.41,35.76 55.23,36.58 55.23,45.58 61.63,51.98 64.52,51.98 FRDM1.PTE3
OUTB_R
  Top 0.61: FRDM1.PTE5 62.42,55.39 61.21,56.59 61.21,61.37 60.6,61.98 43.69,61.98 42.6,61.11 42.6,58.78 41.94,57.89 35.87,57.89 ENCR.4
SCL
  Bottom 0.508: COMP.5 53.99,25.79 56.36,28.17 62.46,28.17 64.06,26.57 71.68,26.57 82.09,16.15 86.25,16.15 88.23,14.18 88.23,10.96 FRDM1.D15
SDA
  Bottom 0.61: FRDM1.D14 86.98,9.89 85.75,11.12 85.75,14 85.47,14.28 82.24,14.4 72.64,24 57.02,23.88 56.53,23.38 COMP.4
STATE
  Top 0.61: FRDM1.PTE29 46.02,53.8 44.17,53.8 42.19,51.82 34.54,51.82 30.68,55.68 19,55.68 15.65,52.32 15.65,45.41 20.55,40.51 BT.6
TRIG  (via drill 0.71 pad 1.27)
  Top 0.406: 23.16,9.93 v23.11,9.93
  Top 0.61: SENS.2 7.9,27.13 9.22,25.81 9.22,18.77 13.49,14.5 13.49,12.45 14.71,11.23 21.87,11.23 23.16,9.93
  Bottom 0.61: FRDM1.PTC16 71.74,12.1 71.73,12.09 71.73,12.45 70.38,13.79 65.51,13.79 64.74,13.03 64.74,6.98 63.88,6.12 44.09,6.12 42.82,4.6 23.95,4.6 23.14,5.66 23.14,9.91 v23.11,9.93
V_ECHO  (via drill 0.71 pad 1.27)
  Top 0.61: R2.2 5.76,15.61 5.6,15.61 v5.33,15.88
  Bottom 0.61: SENS.3 5.06,24.49 3.68,23.11 3.68,17.53 v5.33,15.88
VBAT  (2 unrouted)
  Top 1.194: FET.2 75.99,36.31
  Top 1.27: SJ3.1 70.43,33.52 C16.1 | VDD.3 72.99,30.23 72.03,31.19 72.03,33.21 C16.1 | C16.1 72.35,35.32 73.3,36.27 75.74,36.27 FET.1 | FET.2 76.14,36.2 76.83,36.2
VCC
  Top 1.016: 59.97,25.79 SJ1.2 59.94,25.79 59.94,27.15 59.49,27.61 54.59,27.53 50.19,23.77 33.15,23.77 27.43,28.73 27.41,28.73 24.13,32 24.13,33.15 22.61,34.67 22.61,36.7 23.49,37.59 25.65,37.59 27.43,39.37 27.43,42.27 27.46,42.29 26.7,43.05 BT.5 23.03,43.03 21.44,43.03 19.52,44.95 R7.2
VDD  (via drill 0.71 pad 1.27)  (1 unrouted)
  Top 1.27: 68.55,27.2 70.73,25.15 VDD.1 80.59,25.15 R6.2 82.22,28.37 84.38,30.53 | 68.55,27.2 65.25,27.2 62.86,29.72 C12.1 C11.1 C13.1 55.7,29.74 C14.1 54.15,29.76 48.96,25.51 34.68,25.51 33.53,26.67 33.53,29.21 34.42,30.1 36.77,30.1 DRV.13 | v79.1,45.64 76.68,45.67 C15.1 71.44,45.78 5V.3 | 68.55,27.2 69.37,28.4 SJ3.3 | 36.87,30 DRV.13 | 36.9,29.97 DRV.13
  Bottom 1.27: v79.1,45.64 82.14,45.64 83.57,44.22 83.57,36.32 84.33,35.56 v84.33,30.5
VIN  (via drill 0.71 pad 1.27)
  Top 1.27: SJ3.2 66.9,31.45 64.85,34.14 55.8,34.19 v53.24,37.01
  Bottom 1.27: FRDM1.VIN 62.71,57.79 61.11,57.79 60.27,56.95 60.27,53.16 57.23,50.11 57.12,50.11 53.24,46.23 v53.24,37.01

### Text on the board
Top: FRDM-Robot Rev1.9